# Altium schematic sheet QCopterFCs_Sch.SchDoc: QCopterFCs
size 254 x 152 mm; Author: Hom; CompanyName: KitSprout; DrawnBy: Hom; Engineer: Hom; Organization: KitSprout; Revision: A; SheetNumber: 1; SheetTotal: 1; Version: 1.0; LibVersion: 2.16
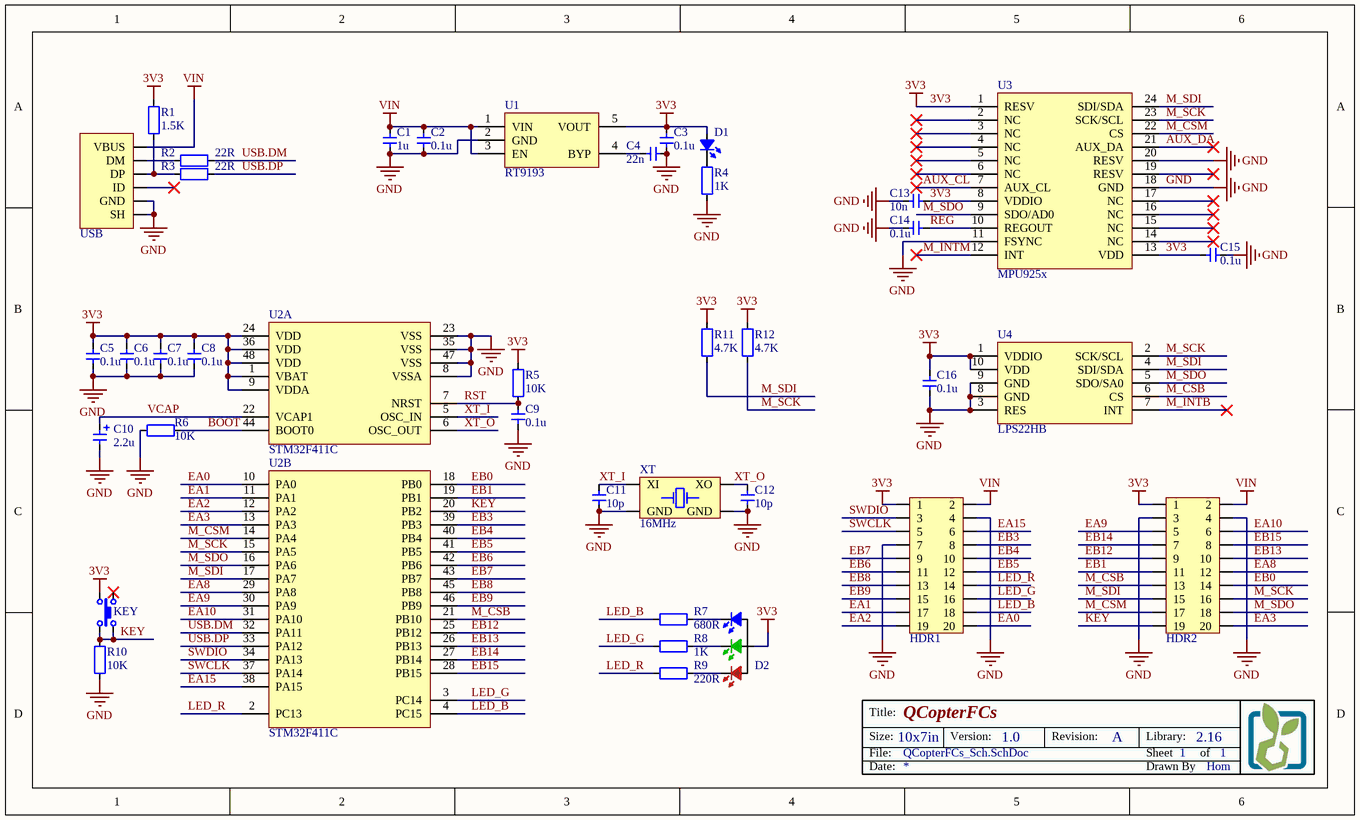
[diagram p0: QCopterFCs_Sch.SchDoc]

## Parts
C1  value 1u  [CAP_0603]  (hidden comment: Cap_0603)
C2  value 0.1u  [CAP_0603]  (hidden comment: Cap_0603)
C3  value 0.1u  [CAP_0603]  (hidden comment: Cap_0603)
C4  value 22n  [CAP_0603]  (hidden comment: Cap_0603)
C5  value 0.1u  [CAP_0402]  (hidden comment: Cap_0402)
C6  value 0.1u  [CAP_0402]  (hidden comment: Cap_0402)
C7  value 0.1u  [CAP_0402]  (hidden comment: Cap_0402)
C8  value 0.1u  [CAP_0402]  (hidden comment: Cap_0402)
C9  value 0.1u  [CAP_0402]  (hidden comment: Cap_0402)
C10  value 2.2u  [CAP_TAN_P0805]  (hidden comment: Cap_Tan_0805)
C11  value 10p  [CAP_0402]  (hidden comment: Cap_0402)
C12  value 10p  [CAP_0402]  (hidden comment: Cap_0402)
C13  value 10n  [CAP_0402]  (hidden comment: Cap_0402)
C14  value 0.1u  [CAP_0402]  (hidden comment: Cap_0402)
C15  value 0.1u  [CAP_0402]  (hidden comment: Cap_0402)
C16  value 0.1u  [CAP_0402]  (hidden comment: Cap_0402)
D1  LED_0603  [LED_0603_YELLOW]  (value not drawn)
D2  LED_1616_RGB  [LED_1616_RGB]  (value not drawn)
HDR1  HDR2x10_1.27  [HDR2X10_1.27_180S]  (value not drawn)
HDR2  HDR2x10_1.27  [HDR2X10_1.27_180S]  (value not drawn)
KEY  ButtonTACT  [ButtonTACT_3.5*3.55_90]  (value not drawn)
R1  value 1.5K  [RES_0402]  (hidden comment: Res_0402)
R2  value 22R  [RES_0402]  (hidden comment: Res_0402)
R3  value 22R  [RES_0402]  (hidden comment: Res_0402)
R4  value 1K  [RES_0603]  (hidden comment: Res_0603)
R5  value 10K  [RES_0402]  (hidden comment: Res_0402)
R6  value 10K  [RES_0402]  (hidden comment: Res_0402)
R7  value 680R  [RES_0402]  (hidden comment: Res_0402)
R8  value 1K  [RES_0402]  (hidden comment: Res_0402)
R9  value 220R  [RES_0402]  (hidden comment: Res_0402)
R10  value 10K  [RES_0402]  (hidden comment: Res_0402)
R11  value 4.7K  [RES_0402]  (hidden comment: Res_0402)
R12  value 4.7K  [RES_0402]  (hidden comment: Res_0402)
U1  RT9193  [SOT23-5]
U2  STM32F411C  [QFN_P0.5_48]  (parts A,B of 2)
U3  MPU925x  [QFN_P0.4_24]
U4  LPS22HB  [HCLGA-2x2_10]
USB  USB_Micro  [USB_Micro-AB]  (value not drawn)
XT  value 16MHz  [XT_2520_4]  (hidden comment: XTAL_2520_4P)

## Nets
3V3: C3.2 C5.2 C6.2 C7.2 C8.2 C13.1 C15.2 C16.1 D1.1(A) D2.4(A) HDR1.1 HDR2.1 KEY.3 R1.2 R5.1 R11.1 R12.1 U1.5(VOUT) U2.1(VBAT) U2.9(VDDA) U2.24(VDD) U2.36(VDD) U2.48(VDD) U3.1(RESV) U3.8(VDDIO) U3.13(VDD) U4.1(VDDIO) U4.10(VDD)
GND: C1.1 C2.1 C3.1 C4.1 C5.1 C6.1 C7.1 C8.1 C9.1 C10.2 C11.1 C12.1 C13.2 C14.2 C15.1 C16.2 HDR1.4 HDR1.7 HDR2.3 HDR2.4 R4.1 R6.1 R10.2 U1.2(GND) U2.8(VSSA) U2.23(VSS) U2.35(VSS) U2.47(VSS) U3.11(FSYNC) U3.18(GND) U3.20(RESV) U4.3(RES) U4.8(GND) U4.9(GND) USB.0(SH) USB.5(GND) XT.2(GND) XT.4(GND)
VIN: C1.2 C2.2 HDR1.2 HDR2.2 U1.1(VIN) U1.3(EN) USB.1(VBUS)
AUX_CL: U3.7(AUX_CL)
AUX_DA: U3.21(AUX_DA)
BOOT: R6.2 U2.44(BOOT0)
EA0: HDR1.20 U2.10(PA0)
EA1: HDR1.17 U2.11(PA1)
EA2: HDR1.19 U2.12(PA2)
EA3: HDR2.20 U2.13(PA3)
EA8: HDR2.12 U2.29(PA8)
EA9: HDR2.5 U2.30(PA9)
EA10: HDR2.6 U2.31(PA10)
EA15: HDR1.6 U2.38(PA15)
EB0: HDR2.14 U2.18(PB0)
EB1: HDR2.11 U2.19(PB1)
EB3: HDR1.8 U2.39(PB3)
EB4: HDR1.10 U2.40(PB4)
EB5: HDR1.12 U2.41(PB5)
EB6: HDR1.11 U2.42(PB6)
EB7: HDR1.9 U2.43(PB7)
EB8: HDR1.13 U2.45(PB8)
EB9: HDR1.15 U2.46(PB9)
EB12: HDR2.9 U2.25(PB12)
EB13: HDR2.10 U2.26(PB13)
EB14: HDR2.7 U2.27(PB14)
EB15: HDR2.8 U2.28(PB15)
KEY: HDR2.19 KEY.2 KEY.4 R10.1 U2.20(PB2)
LED_B: HDR1.18 R7.2 U2.4(PC15)
LED_G: HDR1.16 R8.2 U2.3(PC14)
LED_R: HDR1.14 R9.2 U2.2(PC13)
M_CSB: HDR2.13 U2.21(PB10) U4.6(CS)
M_CSM: HDR2.17 U2.14(PA4) U3.22(CS)
M_INTB: U4.7(INT)
M_INTM: U3.12(INT)
M_SCK: HDR2.16 R12.2 U2.15(PA5) U3.23(SCK/SCL) U4.2(SCK/SCL)
M_SDI: HDR2.15 R11.2 U2.17(PA7) U3.24(SDI/SDA) U4.4(SDI/SDA)
M_SDO: HDR2.18 U2.16(PA6) U3.9(SDO/AD0) U4.5(SDO/SA0)
REG: C14.1 U3.10(REGOUT)
RST: C9.2 R5.2 U2.7(NRST)
SWCLK: HDR1.5 U2.37(PA14)
SWDIO: HDR1.3 U2.34(PA13)
USB.DM: R2.1 U2.32(PA11)
USB.DP: R3.1 U2.33(PA12)
VCAP: C10.1 U2.22(VCAP1)
XT_I: C11.2 U2.5(OSC_IN) XT.1(XI)
XT_O: C12.2 U2.6(OSC_OUT) XT.3(XO)
NetC4_2: C4.2 U1.4(BYP)
NetD1_2: D1.2(K) R4.2
NetD2_1: D2.1(R) R9.1
NetD2_2: D2.2(G) R8.1
NetD2_3: D2.3(B) R7.1
NetR1_1: R1.1 R3.2 USB.3(DP)
NetR2_2: R2.2 USB.2(DM)

Not connected (* = marked no-connect by the designer): KEY 1*; U3 2(NC)* 3(NC)* 4(NC)* 5(NC)* 6(NC)* 14(NC)* 15(NC)* 16(NC)* 17(NC)* 19(RESV)*; USB 4(ID)*

## Notes on the sheet
- Title:
- Size:
- Date:
- File:
- 10x7in
- Version:
- Revision:
- Sheet
- Drawn By
- Library:
- of

## Library data of the parts
C1-C4 = Cap_0603: Capacitor
C5-C9 C11-C16 = Cap_0402: Capacitor
C10 = Cap_Tan_0805: Capacitor
D1 = LED_0603: LED
D2 = LED_1616_RGB: LED
HDR1 HDR2 = HDR2x10_1.27: Header
KEY = ButtonTACT: Button
R1-R3 R5-R12 = Res_0402: Resistor
R4 = Res_0603: Resistor
U1 = RT9193: Power
U2 = STM32F4x1C: MCU
U3 = MPU925x: Sensor Motion
U4 = LPS22HB: Sensor Pressure
USB = USB_Micro: USB
XT = XTAL_2520_4P: Crystal Oscillator